# EAGLE design Tesla v0.1 (EAGLE 6.1)
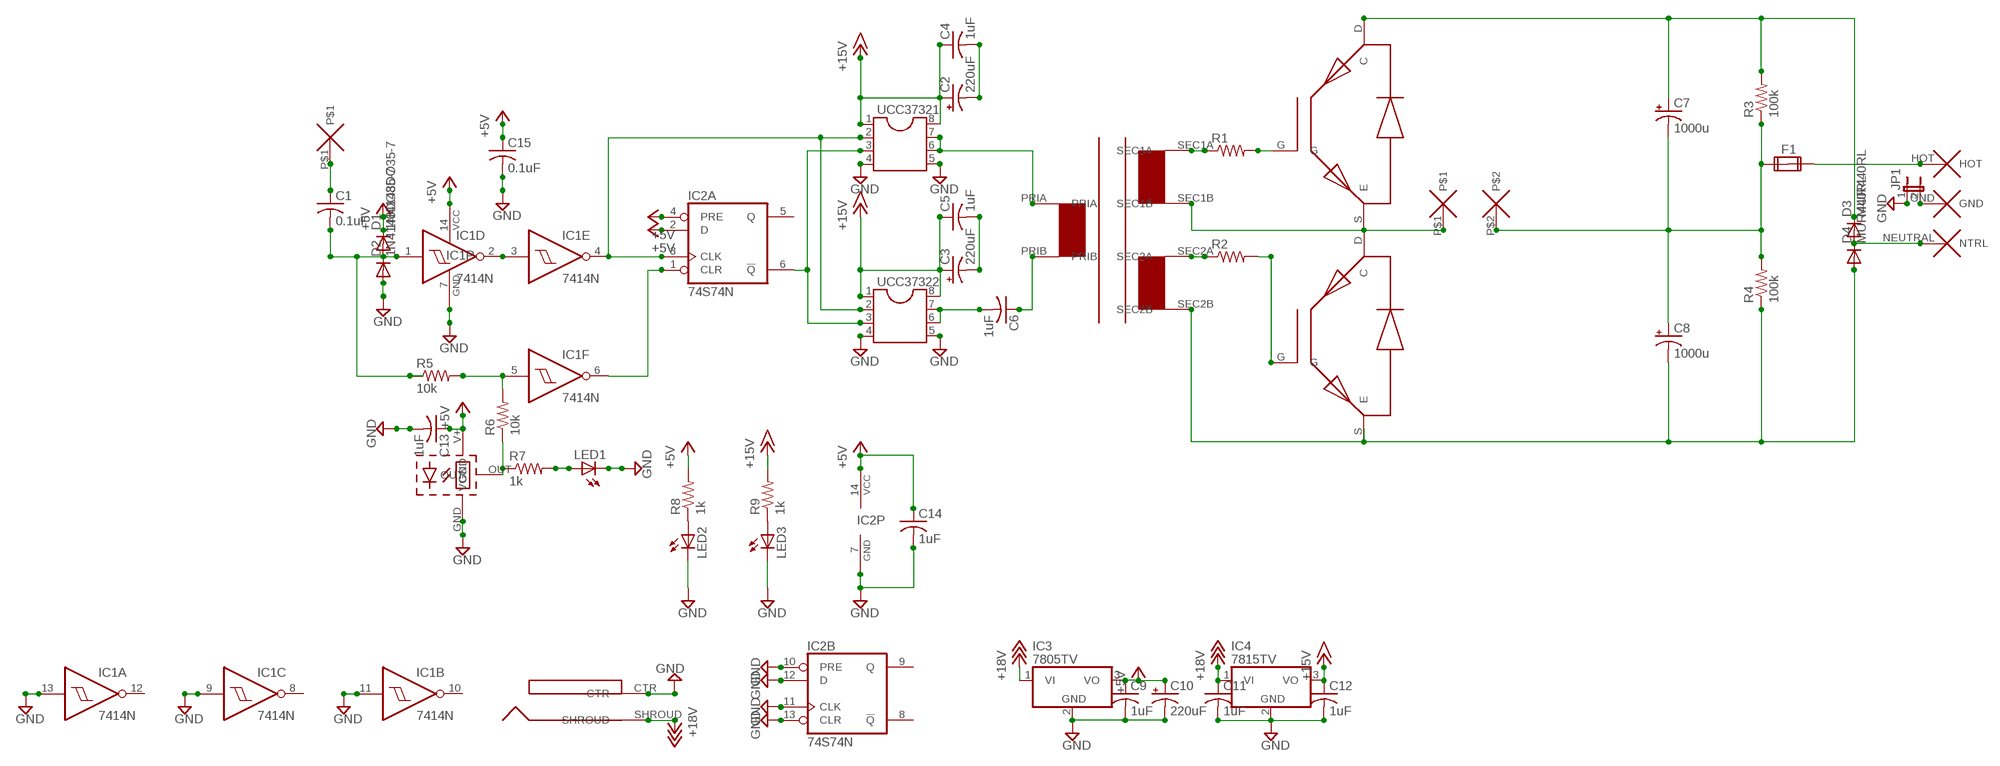
[diagram p0: schematic, sheet 1]

## Parts
C1  0.1uF  C-US050-024X044  [C050-024X044]
C2  220uF  CPOL-USE5-10.5  [E5-10,5]
C3  220uF  CPOL-USE5-10.5  [E5-10,5]
C4  1uF  C-US050-024X044  [C050-024X044]
C5  1uF  C-US050-024X044  [C050-024X044]
C6  1uF  C-US050-024X044  [C050-024X044]
C7  1000u  CPOL-USE10-25  [EB25D]
C8  1000u  CPOL-USE10-25  [EB25D]
C9  1uF  C-US050-024X044  [C050-024X044]
C10  220uF  CPOL-USE5-10.5  [E5-10,5]
C11  1uF  C-US050-024X044  [C050-024X044]
C12  1uF  C-US050-024X044  [C050-024X044]
C13  1uF  C-US050-024X044  [C050-024X044]
C14  1uF  C-US050-024X044  [C050-024X044]
C15  0.1uF  C-US050-024X044  [C050-024X044]
D1  1N4148DO35-7  [DO35-7]
D2  1N4148DO35-7  [DO35-7]
D3  MUR440RL  [C2673]
D4  MUR440RL  [C2673]
F1  FUSE2P  [FUSE1]
IC1  7414N  [DIL14]
IC2  74S74N  [DIL14]
IC3  7805TV  [TO220V]
IC4  7815TV  [TO220V]
JP1  JP1E  [JP1]
LED1  LED5MM  [LED5MM]
LED2  LED5MM  [LED5MM]
LED3  LED5MM  [LED5MM]
R1  R-US_0309/V  [0309V]
R2  R-US_0309/V  [0309V]
R3  100k  R-US_0309/10  [0309/10]
R4  100k  R-US_0309/10  [0309/10]
R5  10k  R-US_0207/7  [0207/7]
R6  10k  R-US_0207/7  [0207/7]
R7  1k  R-US_0207/7  [0207/7]
R8  1k  R-US_0207/7  [0207/7]
R9  1k  R-US_0207/7  [0207/7]
U$1  PJ-037B  [DJC0202]
U$2  12AWG_PAD  [12AWG_PAD]
U$3  GDT  [GDT]
U$4  FGH40N60SMD  [TO247BV]
U$5  FGH40N60SMD  [TO247BV]
U$6  2TERMINAL  [2TERMINAL]
U$7  IEC  [IECPORT]
U$8  IF-D95  [IFD95]
UCC37321  DIL8  [DIL08]
UCC37322  DIL8  [DIL08]

## Nets
+5V: C9.1 C10.+ C13.1 C14.1 C15.1 D1.C IC1.14(P:VCC) IC2.2(A:D) IC2.4(A:PRE) IC2.14(P:VCC) IC3.3(VO) R8.2 U$8.V+(VCC)
+15V: C2.+ C3.+ C4.1 C5.1 C12.1 IC4.3(VO) R9.2 UCC37321.1 UCC37321.8 UCC37322.1 UCC37322.8
+18V: C11.1 IC3.1(VI) IC4.1(VI) U$1.SHROUD
GND: C9.2 C10.- C11.2 C12.2 C13.2 C14.2 C15.2 D2.A IC1.7(P:GND) IC1.9(C:I) IC1.11(B:I) IC1.13(A:I) IC2.7(P:GND) IC2.10(B:PRE) IC2.11(B:CLK) IC2.12(B:D) IC2.13(B:CLR) IC3.2(GND) IC4.2(GND) JP1.1 LED1.K(C) LED2.K(C) LED3.K(C) U$1.CTR U$8.GND UCC37321.4 UCC37321.5 UCC37322.4 UCC37322.5
N$1: C1.1 U$2.P$1
N$2: C1.2 D1.A D2.C IC1.1(D:I) R5.1
N$3: IC1.4(E:O) IC2.3(A:CLK) UCC37321.2 UCC37322.2
N$4: IC1.6(F:O) IC2.1(A:CLR)
N$5: IC2.6(A:!Q) UCC37321.3 UCC37322.3
N$6: C2.- C4.2
N$7: C3.- C5.2
N$8: U$3.PRIA UCC37321.6 UCC37321.7
N$9: C6.2 UCC37322.6 UCC37322.7
N$10: C6.1 U$3.PRIB
N$11: U$3.SEC1B U$4.S(E) U$5.D(C) U$6.P$1
N$12: R1.1 U$3.SEC1A
N$13: R1.2 U$4.G
N$14: R2.1 U$3.SEC2A
N$15: R2.2 U$5.G
N$16: IC1.5(F:I) R5.2 R6.2
N$17: R6.1 R7.1 U$8.OUT
N$18: C7.- C8.+ F1.1A R3.1 R4.2 U$6.P$2
N$19: D3.A D4.C U$7.NEUTRAL(NTRL)
N$20: F1.2A U$7.HOT
N$21: JP1.2 U$7.GND
N$23: LED1.A R7.2
N$24: LED2.A R8.1
N$25: LED3.A R9.1
N$28: IC1.2(D:O) IC1.3(E:I)
V+: C7.+ D3.C R3.2 U$4.D(C)
V-: C8.- D4.A R4.1 U$3.SEC2B U$5.S(E)
Unconnected: F1.1B F1.2B IC1.8(C:O) IC1.10(B:O) IC1.12(A:O) IC2.5(A:Q) IC2.8(B:!Q) IC2.9(B:Q)

## Library data of the parts
C1 C4-C6 C9 C11-C15 = adafruit:C-US: CAPACITOR, American symbol
C2 C3 C7 C8 C10 = adafruit:CPOL-US: POLARIZED CAPACITOR, American symbol
D1 D2 = diode:1N4148: DIODE high speed (Philips)
D3 D4 = diode:MUR440RL: DIODE ultra-fast recovery rectifier, Vrrm = 40 V, 4 A
F1 = special:FUSE2P: FUSE 5 x 20 mm
IC1 = 74xx-us:74*14: Hex schmitt trigger INVERTER
IC2 = 74xx-us:74*74: Dual D type positive edge triggered FLIP FLOP, preset and clear
IC3 IC4 = linear:78*: Positive VOLTAGE REGULATOR Source: http://cache.national.com/ds/LM/LM78L05.pdf http://www.fairchildsemi.com/ds/LM/LM7805.pdf
JP1 = jumper:JP1E: JUMPER
LED1-LED3 = adafruit:LED: LED OSRAM: - CHIPLED LG R971, LG N971, LY N971, LG Q971, LY Q971, LO R971, LY R971 LH N974, LH R974 LS Q976, LO Q976, LY Q976 LO Q996 - Hyper CHIPLED LW Q18S LB Q993, LB Q99A, LB R99A - SideLED LS A670, LO A670, LY A670, LG A670, LP A670 LB A673, LV A673, LT A673, LW A673 LH A674 LY A675 LS A676, LA A676, LO A676, LY A676, LW A676 LS A679, LY A679, LG A679 - Hyper Micro SIDELED® LS Y876, LA Y876, LO Y876, LY Y876 LT Y87S - SmartLED LW L88C, LW L88S LB L89C, LB L89S, LG L890 LS L89K, LO L89K, LY L89K LS L896, LA L896, LO L896, LY L896 - TOPLED LS T670, LO T670, LY T670, LG T670, LP T670 LSG T670, LSP T670, LSY T670, LOP T670, LYG T670 LG T671, LOG T671, LSG T671 LB T673, LV T673, LT T673, LW T673 LH T674 LS T676, LA T676, LO T676, LY T676, LB T676, LH T676, LSB T676, LW T676 LB T67C, LV T67C, LT T67C, LS T67K, LO T67K, LY T67K, LW E67C LS E67B, LA E67B, LO E67B, LY E67B, LB E67C, LV E67C, LT E67C LW T67C LS T679, LY T679, LG T679 LS T770, LO T770, LY T770, LG T770, LP T770 LB T773, LV T773, LT T773, LW T773 LH T774 LS E675, LA E675, LY E675, LS T675 LS T776, LA T776, LO T776, LY T776, LB T776 LHGB T686 LT T68C, LB T68C - Hyper Mini TOPLED® LB M676 - Mini TOPLED Santana® LG M470 LS M47K, LO M47K, LY M47K Source: http://www.osram.convergy.de/
R1-R9 = adafruit:R-US_: RESISTOR, American symbol
U$1 = onecoil:PJ-037B
U$2 = onecoil:12AWG_PAD
U$3 = onecoil:GDT: Half-Bridge GDT
U$4 U$5 = onecoil:FGH40N60SMD
U$6 = onecoil:2TERMINAL
U$7 = onecoil:IEC
U$8 = onecoil with logo:IF-D95
UCC37321 UCC37322 = ic-package:DIL8: Dual In Line / Socket

## Board
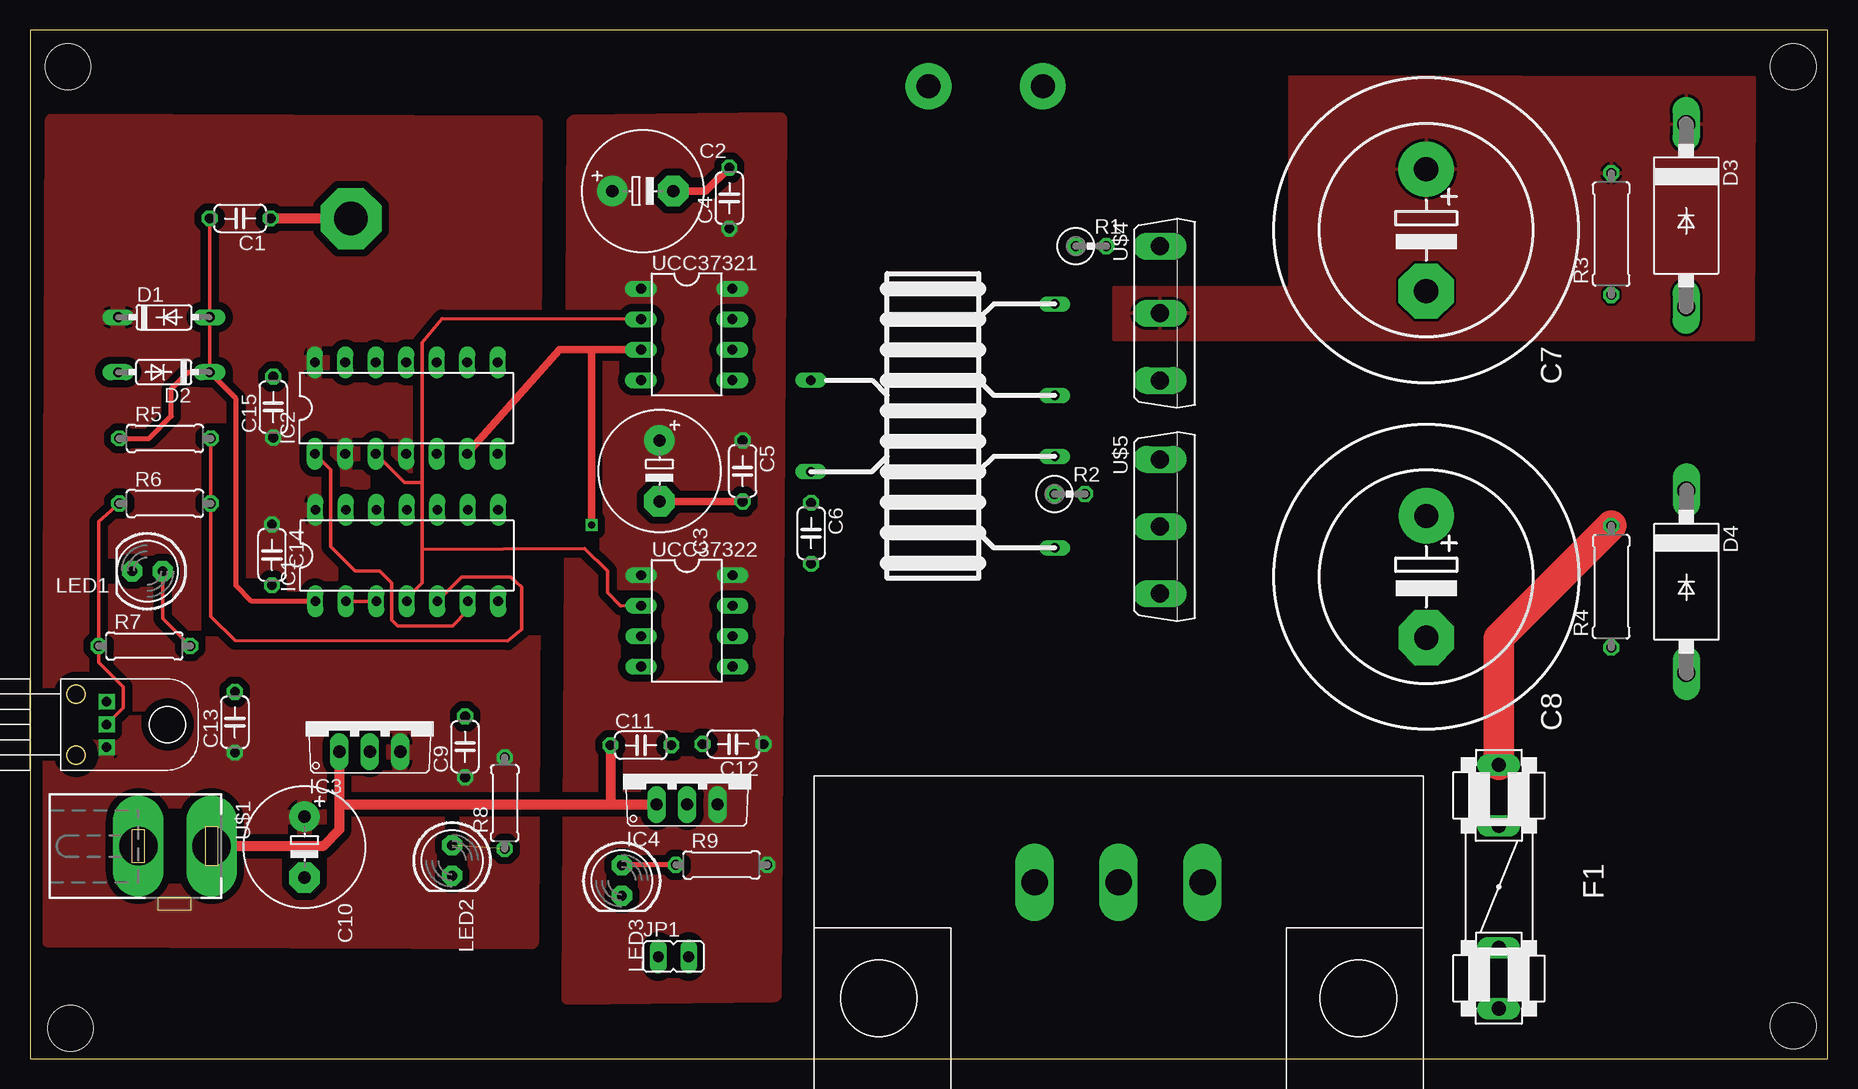
[diagram p1: board, top side]
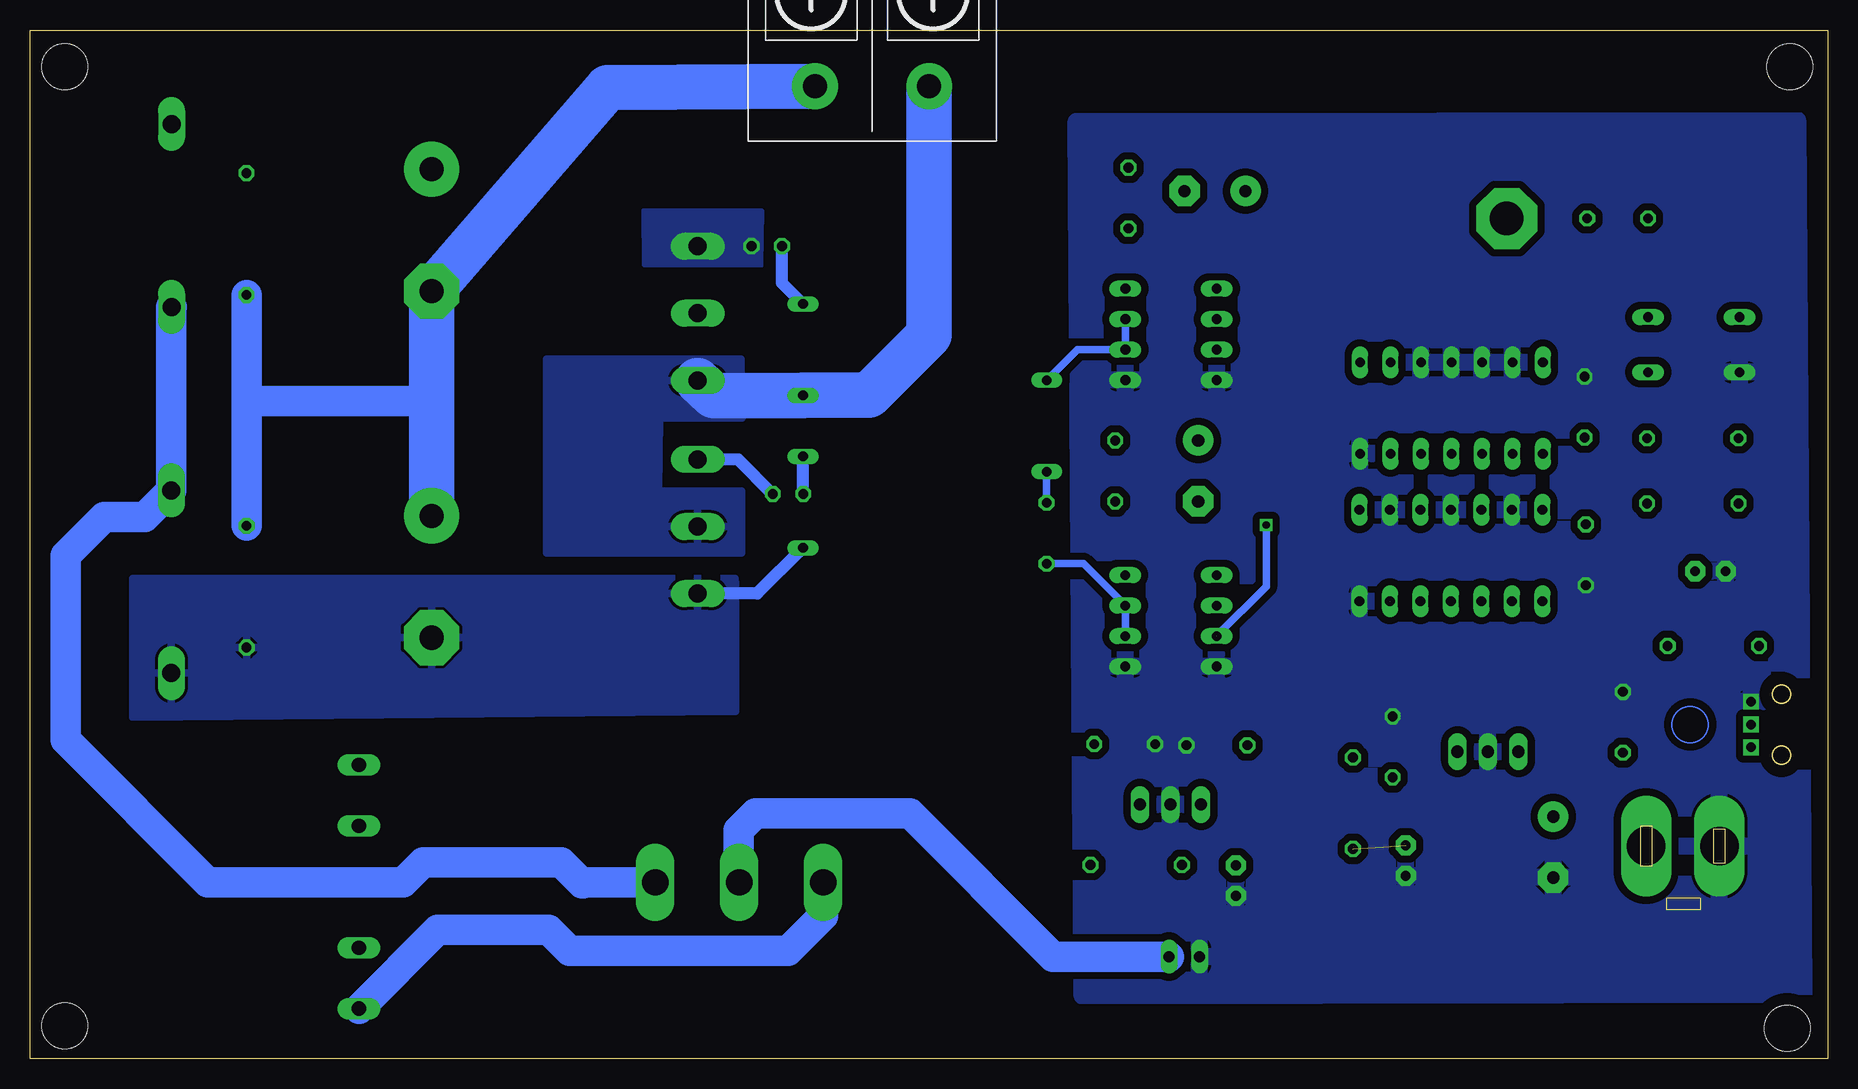
[diagram p2: board, bottom side, seen from below]

Size 149.85 x 85.78 mm. Coordinates in mm from the lower left corner, seen from the top.
Outline: 0,0 149.85,0 149.85,85.78 0,85.78 0,0
Copper layers (1*16): Top 0.035mm / dielectric 1.5mm / Bottom 0.035mm
Design rules: minimum track width 10mil, minimum drill 24mil, track to track 8mil, track to pad 8mil, pad to pad 8mil, via to via 8mil, smd to smd 8mil, copper to edge 40mil, drill to drill 8mil, minimum pad ring 10mil, minimum via ring 8mil, stop-mask expansion 4mil, vias tented up to drill 0mil, thermal gap 10mil
Holes 3.81 mm at 146.96,82.71 3.17,82.71 3.37,2.56 146.96,2.77

### Footprints (pad centres in the part's own frame; a part is rotated, then mirrored left to right if it is on the bottom)
C050-024X044 = drill 0.813 octagon: 1 -2.54,0; 2 2.54,0
E5-10,5 = drill 1.016 pad 2.54: + -2.54,0 | drill 1.016 pad 2.54 octagon: - 2.54,0
EB25D = drill 2.007 pad 4.597: + -5.08,0 | drill 2.007 pad 4.597 octagon: - 5.08,0
DO35-7 = drill 0.813 long: A 3.81,0; C -3.81,0
C2673 = drill 1.499 long: A 7.62,0; C -7.62,0
FUSE1 = drill 1.194 long: 1A -10.16,0; 1B -5.08,0; 2A 10.16,0; 2B 5.08,0
DIL14 = drill 0.813 long: 1 -7.62,-3.81; 2 -5.08,-3.81; 3 -2.54,-3.81; 4 0,-3.81; 5 2.54,-3.81; 6 5.08,-3.81; 7 7.62,-3.81; 8 7.62,3.81; 9 5.08,3.81; 10 2.54,3.81; 11 0,3.81; 12 -2.54,3.81; 13 -5.08,3.81; 14 -7.62,3.81
TO220V = drill 1.016 long: 1 -2.54,-2.54; 2 0,-2.54; 3 2.54,-2.54
JP1 = drill 0.914 long: 1 0,-1.27; 2 0,1.27
LED5MM = drill 0.813 pad 1.676 octagon: A -1.27,0; K 1.27,0
0309V = drill 0.813 octagon: 1 -1.27,0; 2 1.27,0
0309/10 = drill 0.813 octagon: 1 -5.08,0; 2 5.08,0
0207/7 = drill 0.813 octagon: 1 -3.81,0; 2 3.81,0
DJC0202 = drill 3.2 pad 3.81 long: CTR 0,-3; SHROUD 0,3.1
12AWG_PAD = drill 2.8 pad 5.08 octagon: P$1 0,0
GDT = drill 0.8 long: PRIA -10.16,3.81; PRIB -10.16,-3.81; SEC1A 10.16,10.16; SEC1B 10.16,2.54; SEC2A 10.16,-2.54; SEC2B 10.16,-10.16
TO247BV = drill 1.499 long: D 0,-0.381; G -5.588,-0.381; S 5.588,-0.381
2TERMINAL = drill 2 pad 3.81: P$1 -4.763,0; P$2 4.763,0
IECPORT = drill 2.2 long: GND 0,0; HOT -7,0; NEUTRAL 7,0
IFD95 = drill 0.8 square: GND 1.905,5.08; OUT 0,5.08; V+ -1.905,5.08
DIL08 = drill 0.813 long: 1 -3.81,-3.81; 2 -1.27,-3.81; 3 1.27,-3.81; 4 3.81,-3.81; 5 3.81,3.81; 6 1.27,3.81; 7 -1.27,3.81; 8 -3.81,3.81

### Placement (x,y rotation side)
C1  17.51,70.07 180 top
C2  51.08,72.35 0 top
C3  52.47,49.02 270 top
C4  58.29,71.77 90 top
C5  59.4,49.01 270 top
C6  65.11,43.82 270 top
C7  116.38,69.09 270 top
C8  116.39,40.2 270 top
C9  36.26,26.02 90 top
C10  22.88,17.65 270 top
C11  50.92,26.15 0 top
C12  58.61,26.25 180 top
C13  17.08,28.07 90 top
C14  20.17,42.02 270 top
C15  20.27,54.34 90 top
D1  11.16,61.84 0 top
D2  11.16,57.24 180 top
D3  138.05,70.31 270 top
D4  138.06,39.78 270 top
F1  122.44,14.34 270 top
IC1  31.41,41.96 0 top
IC2  31.36,54.26 0 top
IC3  28.33,28.15 0 top
IC4  54.78,23.75 0 top
JP1  53.64,8.53 270 top
LED1  9.79,40.66 180 top
LED2  35.18,16.54 270 top
LED3  49.33,14.87 270 top
R1  88.45,67.76 0 top
R2  86.67,47.1 0 top
R3  131.81,68.77 90 top
R4  131.81,39.37 90 top
R5  11.26,51.73 0 top
R6  11.25,46.31 0 top
R7  9.53,34.43 0 top
R8  39.57,21.32 90 top
R9  57.65,16.17 0 top
U$1  12.03,17.74 270 top
U$2  26.76,70.06 0 top
U$3  75.26,52.77 0 top
U$4  94.57,62.16 270 top
U$5  94.57,44.38 270 top
U$6  79.66,81.1 180 bottom
U$7  90.74,14.72 0 top
U$8  11.47,27.88 90 top
UCC37321  54.74,60.4 270 top
UCC37322  54.75,36.52 270 top

### Tracks (layer width: path | path; a pad name or v marks a point on that pad's centre or on a via)
+5V
  pour Top (isolate 0.61): 1.87,78.23 42.12,78.07 41.8,9.73 1.55,9.89
+15V
  pour Top (isolate 0.61, no thermals): 45.32,78.09 44.88,5.13 62.07,5.36 62.51,78.31
+18V
  Top 0.813: IC3.1 25.79,21.21 | 25.79,21.21 48.38,21.21 | 48.38,21.21 IC4.1 | C11.1 48.38,21.21 | 25.79,21.21 25.79,19.1 24.42,17.72 15.14,17.72 U$1.SHROUD
GND
  pour Bottom (isolate 0.61): 2.5,78.26 1.99,5.32 62.15,5.22 62.66,78.16
N$1
  Top 0.813: U$2.P$1 C1.1
N$2
  Top 0.305: D2.C D1.A C1.2
  Top 0.406: IC1.1 18.49,38.15 17.18,39.46 17.18,55.03 D2.C 13.18,57.25 11.79,55.86 11.79,53.58 9.94,51.73 R5.1
N$3
  Top 0.305: IC2.3 31.23,48.04 32.69,48.04 | 32.69,48.04 32.69,42.45 | IC1.4 31.41,38.38 32.69,39.66 32.69,42.45 | 32.69,42.45 46.25,42.54 48.13,40.66 48.13,38.9 49.23,37.75 UCC37322.2 | UCC37321.2 34.37,61.72 32.69,59.72 32.69,48.04
N$4  (1 unrouted)
  Top 0.305: IC2.1 25.07,49.12 25.07,42.7 27.1,40.67 29.13,40.67 30.15,39.66 30.15,36.61 30.66,36.1 35.23,36.1 36.5,37.37 36.5,38.13
N$5  (via drill 0.6)  (1 unrouted)
  Top 0.61: IC2.6 44.15,59.13 46.83,59.13 | 46.83,59.13 UCC37321.3 | 46.83,44.62 46.83,59.13
  Top 0.813: v46.81,44.52 46.83,44.62
  Bottom 0.305: UCC37322.3 50.94,35.25
  Bottom 0.61: v46.81,44.52 46.81,39.38 UCC37322.3
N$6
  Top 0.61: C2.- 56.33,72.35 C4.2
N$7
  Top 0.61: C3.- C5.2
N$8
  Bottom 0.61: UCC37321.7 UCC37321.6 62.55,59.13 U$3.PRIA
N$9
  Bottom 0.61: UCC37322.6 UCC37322.7 62.06,41.28 C6.2
N$10
  Bottom 0.61: C6.1 65.11,48.94 U$3.PRIB
N$11
  Bottom 3.81: U$6.P$1 74.9,60.34 79.91,55.33 85.4,55.33 U$3.SEC1B 92.88,55.31 U$4.S
  pour Bottom: 90.52,53.41 97.36,53.42 97.44,47.33 90.55,47.33 90.55,42.16 106.81,42.16 106.81,58.34 90.58,58.34
N$12
  Bottom 1.016: U$3.SEC1A 87.18,64.69 R1.1
N$13
  pour Bottom (no thermals): 88.9,66.16 88.85,70.71 98.72,70.69 98.65,66.21
N$14
  Bottom 1.016: R2.1 85.4,50.21 U$3.SEC2A
N$15
  Bottom 1.016: R2.2 90.81,49.97 U$5.G
N$16
  Top 0.305: IC1.5 35.96,40.16 40.05,40.16 40.98,39.35 40.98,35.79 39.8,34.83 17.09,34.89 15.06,36.89 R6.2 R5.2
N$17
  Top 0.305: R6.1 5.72,44.79 R7.1 5.72,33.04 7.77,30.99 7.77,29.26 U$8.OUT
N$18
  Top 2.54: R4.2 122.44,35.08 F1.1A
  Bottom 2.54: R4.2 131.81,54.83 | 131.81,54.83 131.81,63.66 R3.1 | C8.+ 116.39,54.83 131.81,54.83
  Bottom 3.81: C8.+ C7.- 101.71,80.98 U$6.P$2
N$19
  Bottom 2.54: D3.A 138.06,62.69 D4.C 140.28,45.18 143.68,45.18 146.89,41.97 146.89,26.59 135.03,14.72 118.75,14.72 117.09,16.38 105.57,16.38 103.83,14.64 103.73,14.64 103.66,14.72 U$7.NEUTRAL
N$20
  Bottom 2.54: U$7.HOT 83.74,11.91 86.65,8.99 104.88,8.99 106.64,10.76 115.87,10.76 F1.2A
N$21
  Bottom 2.54: JP1.2 64.59,8.53 76.51,20.45 89.37,20.45 90.77,19.05 90.77,14.75 U$7.GND
N$23
  Top 0.305: LED1.A 11.05,36.72 R7.2
N$24  (1 unrouted)
N$25
  Top 0.406: R9.1 49.33,16.17 LED3.A
N$28
  Top 0.305: IC1.2 IC1.3
V+
  pour Top: 90.37,59.97 143.64,59.96 143.74,81.81 105.02,81.89 105.02,64.31 90.37,64.31
V-
  Bottom 1.016: U$3.SEC2B 89.23,38.79 U$5.S
  pour Bottom: 91.06,40.06 141.31,40.05 141.31,28.45 91.04,28.96 91.04,39.59